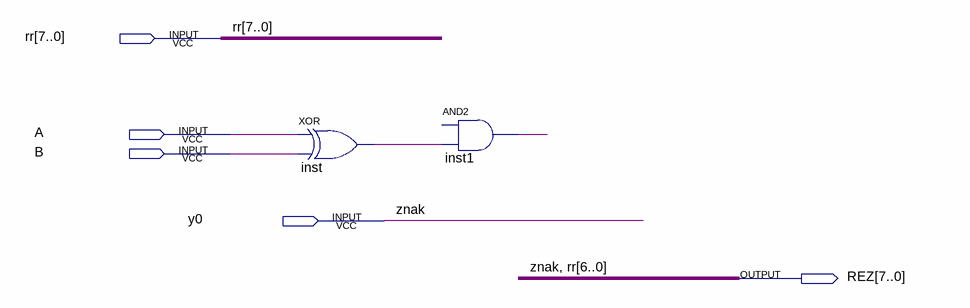
[diagram p0: schematic sheet]
// Quartus schematic KC5.bdf as structural Verilog: 2 symbols, 5 pins
module KC5 (
  input  [7:0] rr,
  input  A,
  input  B,
  input  y0,
  output [7:0] REZ
);

  wire inst1_out, inst_out;

  xor inst (inst_out, A, B);
  buf inst1 (inst1_out, inst_out);  // AND2 open: IN1

  assign REZ = {y0, rr[6:0]};

  // Other names for the same wires on the sheet: znak = y0
endmodule
